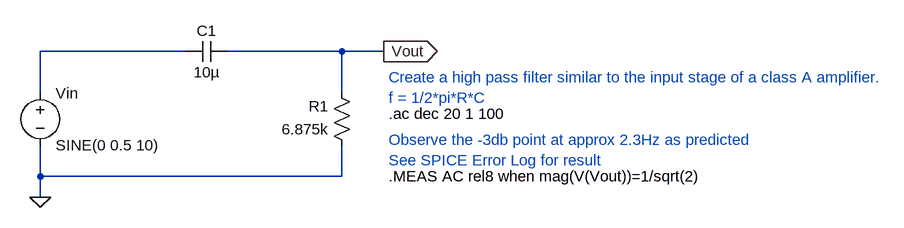
[diagram p0: schematic High_pass_filter.asc]
High_pass_filter.asc, the LTspice schematic file:
Version 4
SHEET 1 1368 680
WIRE 288 272 64 272
WIRE 528 272 352 272
WIRE 592 272 528 272
WIRE 64 336 64 272
WIRE 528 336 528 272
WIRE 64 464 64 416
WIRE 528 464 528 416
WIRE 528 464 64 464
WIRE 64 496 64 464
FLAG 64 496 0
FLAG 592 272 Vout
IOPIN 592 272 Out
SYMBOL voltage 64 320 R0
SYMATTR InstName Vin
SYMATTR Value SINE(0 0.5 10)
SYMATTR Value2 AC 1
SYMBOL res 544 432 R180
WINDOW 0 36 76 Left 2
WINDOW 3 36 40 Left 2
SYMATTR InstName R1
SYMATTR Value 6.875k
SYMBOL cap 352 256 R90
WINDOW 0 0 32 VBottom 2
WINDOW 3 32 32 VTop 2
SYMATTR InstName C1
SYMATTR Value 10µ
TEXT 600 312 Left 2 ;Create a high pass filter similar to the input stage of a class A amplifier.\nf = 1/2*pi*R*C
TEXT 600 368 Left 2 !.ac dec 20 1 100
TEXT 600 408 Left 2 ;Observe the -3db point at approx 2.3Hz as predicted\nSee SPICE Error Log for result
TEXT 600 464 Left 2 !.MEAS AC rel8 when mag(V(Vout))=1/sqrt(2)

The netlist it stands for:
* High_pass_filter.asc
Vin N001 0 SINE(0 0.5 10) AC 1
R1 0 Vout 6.875k
C1 Vout N001 10µ
* Create a high pass filter similar to the input stage of a class A amplifier.
* f = 1/2*pi*R*C
.ac dec 20 1 100
* Observe the -3db point at approx 2.3Hz as predicted
* See SPICE Error Log for result
.MEAS AC rel8 when mag(V(Vout))=1/sqrt(2)
.backanno
.end